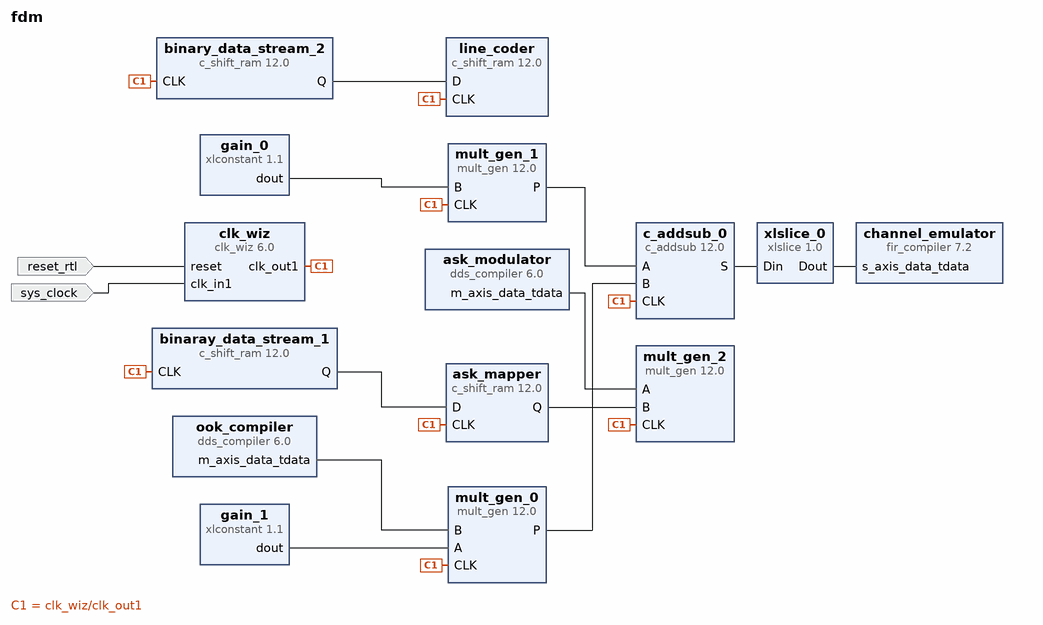
[diagram p0: block diagram of the top level]
# Vivado block design fdm, xc7z020clg400-1, Vivado 2025.2
create_bd_design fdm

create_bd_port -dir I -type clk sys_clock
set_property -dict {CONFIG.FREQ_HZ 125000000 CONFIG.PHASE 0.0} [get_bd_ports sys_clock]
create_bd_port -dir I -type rst reset_rtl
set_property -dict {CONFIG.POLARITY ACTIVE_HIGH} [get_bd_ports reset_rtl]

create_bd_cell -type ip -vlnv xilinx.com:ip:c_shift_ram:12.0 line_coder
create_bd_cell -type ip -vlnv xilinx.com:ip:dds_compiler:6.0 ook_compiler
create_bd_cell -type ip -vlnv xilinx.com:ip:fir_compiler:7.2 channel_emulator
create_bd_cell -type ip -vlnv xilinx.com:ip:c_addsub:12.0 c_addsub_0
set_property -dict [list \
  CONFIG.A_Width 23 \
  CONFIG.B_Value 00000000000000000000000 \
  CONFIG.B_Width 23 \
  CONFIG.Latency 1 \
  CONFIG.Out_Width 23 \
] [get_bd_cells c_addsub_0]
create_bd_cell -type ip -vlnv xilinx.com:ip:dds_compiler:6.0 ask_modulator
create_bd_cell -type ip -vlnv xilinx.com:ip:c_shift_ram:12.0 ask_mapper
create_bd_cell -type ip -vlnv xilinx.com:ip:mult_gen:12.0 mult_gen_0
set_property -dict {CONFIG.PortAWidth 7} [get_bd_cells mult_gen_0]
create_bd_cell -type ip -vlnv xilinx.com:ip:mult_gen:12.0 mult_gen_1
create_bd_cell -type ip -vlnv xilinx.com:ip:xlconstant:1.1 gain_0
set_property -dict {CONFIG.CONST_VAL 100 CONFIG.CONST_WIDTH 7} [get_bd_cells gain_0]
create_bd_cell -type ip -vlnv xilinx.com:ip:xlconstant:1.1 gain_1
set_property -dict {CONFIG.CONST_VAL 100 CONFIG.CONST_WIDTH 7} [get_bd_cells gain_1]
create_bd_cell -type ip -vlnv xilinx.com:ip:c_shift_ram:12.0 binaray_data_stream_1
create_bd_cell -type ip -vlnv xilinx.com:ip:c_shift_ram:12.0 binary_data_stream_2
create_bd_cell -type ip -vlnv xilinx.com:ip:clk_wiz:6.0 clk_wiz
set_property -dict [list \
  CONFIG.CLKOUT1_REQUESTED_OUT_FREQ 100.0 \
  CONFIG.CLK_IN1_BOARD_INTERFACE sys_clock \
  CONFIG.USE_BOARD_FLOW true \
] [get_bd_cells clk_wiz]
create_bd_cell -type ip -vlnv xilinx.com:ip:xlslice:1.0 xlslice_0
set_property -dict {CONFIG.DIN_FROM 22 CONFIG.DIN_TO 7 CONFIG.DIN_WIDTH 23 CONFIG.DOUT_WIDTH 16} [get_bd_cells xlslice_0]
create_bd_cell -type ip -vlnv xilinx.com:ip:mult_gen:12.0 mult_gen_2
set_property -dict {CONFIG.PortAWidth 16 CONFIG.PortBWidth 16} [get_bd_cells mult_gen_2]

# ---- connections ----

connect_bd_net [get_bd_pins clk_wiz/clk_out1] \
  [get_bd_pins binary_data_stream_2/CLK] [get_bd_pins line_coder/CLK] [get_bd_pins mult_gen_0/CLK] \
  [get_bd_pins mult_gen_1/CLK] [get_bd_pins c_addsub_0/CLK] [get_bd_pins binaray_data_stream_1/CLK] \
  [get_bd_pins ask_mapper/CLK] [get_bd_pins mult_gen_2/CLK]
connect_bd_net [get_bd_pins ask_mapper/Q] [get_bd_pins mult_gen_2/B]
connect_bd_net [get_bd_pins ask_modulator/m_axis_data_tdata] [get_bd_pins mult_gen_2/A]
connect_bd_net [get_bd_pins binaray_data_stream_1/Q] [get_bd_pins ask_mapper/D]
connect_bd_net [get_bd_pins binary_data_stream_2/Q] [get_bd_pins line_coder/D]
connect_bd_net [get_bd_pins c_addsub_0/S] [get_bd_pins xlslice_0/Din]
connect_bd_net [get_bd_pins mult_gen_0/P] [get_bd_pins c_addsub_0/B]
connect_bd_net [get_bd_pins mult_gen_1/P] [get_bd_pins c_addsub_0/A]
connect_bd_net [get_bd_pins ook_compiler/m_axis_data_tdata] [get_bd_pins mult_gen_0/B]
connect_bd_net [get_bd_ports reset_rtl] [get_bd_pins clk_wiz/reset]
connect_bd_net [get_bd_ports sys_clock] [get_bd_pins clk_wiz/clk_in1]
connect_bd_net -net xlconstant_0_dout [get_bd_pins gain_0/dout] [get_bd_pins mult_gen_1/B]
connect_bd_net -net xlconstant_1_dout [get_bd_pins gain_1/dout] [get_bd_pins mult_gen_0/A]
connect_bd_net [get_bd_pins xlslice_0/Dout] [get_bd_pins channel_emulator/s_axis_data_tdata]

validate_bd_design
save_bd_design
